# Altium project DC_Measure.PrjPcb
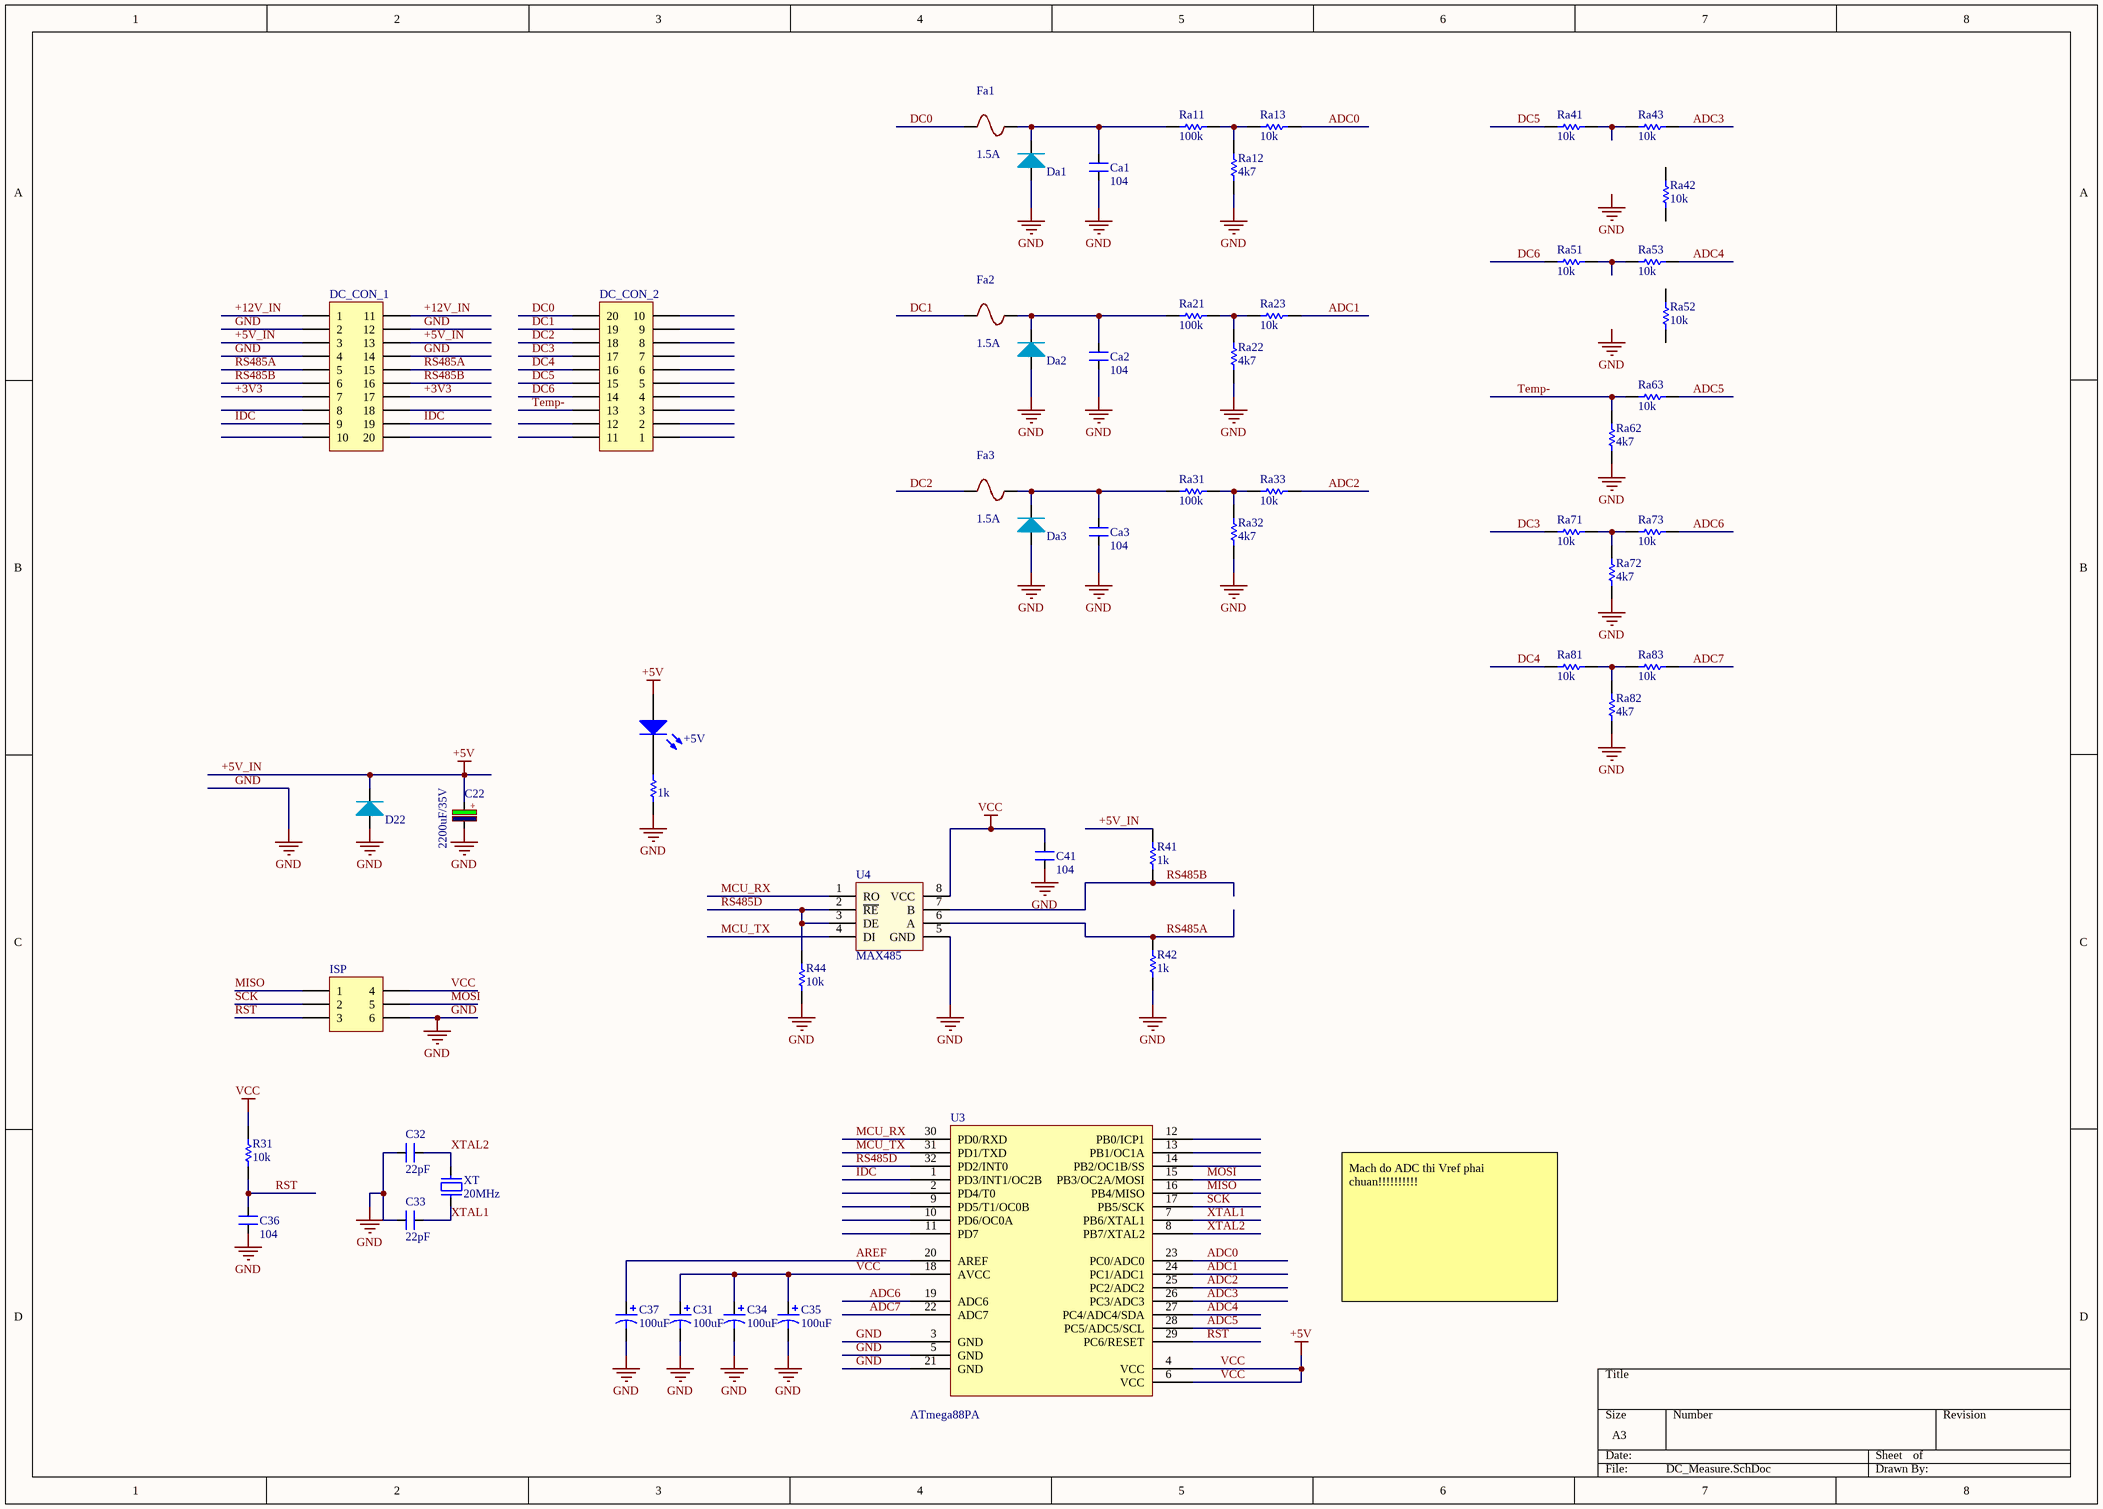
[diagram p0: DC_Measure.SchDoc]
1 sheet, 54 parts. Net scope: global (net labels, ports and power ports of the same name join across sheets).
Board file: DC_Measure.PcbDoc

## Sheet DC_Measure.SchDoc
size A3

### Parts
+5V  Led  [LED 5mm RED]  (value not drawn)
C22  2200uF/35V  [CAP_ELEC_SIZE_G]
C31  value 100uF  [CAPC2012N_F]  (hidden comment: Cap)
C32  value 22pF  [CAPC1608N]  (hidden comment: CAP NP)
C33  value 22pF  [CAPC1608N]  (hidden comment: CAP NP)
C34  value 100uF  [CAPC2012N_F]  (hidden comment: Cap)
C35  value 100uF  [CAPC2012N_F]  (hidden comment: Cap)
C36  value 104  [CAPC1608N]  (hidden comment: CAP NP)
C37  value 100uF  [CAPC2012N_F]  (hidden comment: Cap)
C41  value 104  [CAPC2012N_F]  (hidden comment: 100nF/104)
Ca1  value 104  [CAPC2012N_F]  (hidden comment: CAP NP)
Ca2  value 104  [CAPC2012N_F]  (hidden comment: CAP NP)
Ca3  value 104  [CAPC2012N_F]  (hidden comment: CAP NP)
D22  Diode  [DO-214AC]  (value not drawn)
Da1  Diode  [DO-214AC]  (value not drawn)
Da2  Diode  [DO-214AC]  (value not drawn)
Da3  Diode  [DO-214AC]  (value not drawn)
DC_CON_1  Header 10X2A  [OMC10]  (value not drawn)
DC_CON_2  Header 10X2A  [OMC10]  (value not drawn)
Fa1  1.5A  [SMD 1206]
Fa2  1.5A  [SMD 1206]
Fa3  1.5A  [SMD 1206]
ISP  Header 3X2A  [HDR2X3_CEN]  (value not drawn)
R22  value 1k  [RESC2012N_F]  (hidden comment: Res_0805_1k)
R31  value 10k  [RESC1608N_ZERO]  (hidden comment: Res)
R41  1k  [RESC1608N_ZERO]
R42  1k  [RESC1608N_ZERO]
R44  value 10k  [RESC1608N_ZERO]  (hidden comment: 330R)
Ra11  value 100k  [RESC2012N_F]  (hidden comment: Res)
Ra12  value 4k7  [RESC2012N_F]  (hidden comment: Res)
Ra13  value 10k  [RESC2012N_F]  (hidden comment: Res)
Ra21  value 100k  [RESC2012N_F]  (hidden comment: Res)
Ra22  value 4k7  [RESC2012N_F]  (hidden comment: Res)
Ra23  value 10k  [RESC2012N_F]  (hidden comment: Res)
Ra31  value 100k  [RESC2012N_F]  (hidden comment: Res)
Ra32  value 4k7  [RESC2012N_F]  (hidden comment: Res)
Ra33  value 10k  [RESC2012N_F]  (hidden comment: Res)
Ra41  value 10k  [RESC2012N_F]  (hidden comment: Res)
Ra42  value 10k  [RESC2012N_F]  (hidden comment: Res)
Ra43  value 10k  [RESC2012N_F]  (hidden comment: Res)
Ra51  value 10k  [RESC2012N_F]  (hidden comment: Res)
Ra52  value 10k  [RESC2012N_F]  (hidden comment: Res)
Ra53  value 10k  [RESC2012N_F]  (hidden comment: Res)
Ra62  value 4k7  [RESC2012N_F]  (hidden comment: Res)
Ra63  value 10k  [RESC2012N_F]  (hidden comment: Res)
Ra71  value 10k  [RESC2012N_F]  (hidden comment: Res)
Ra72  value 4k7  [RESC2012N_F]  (hidden comment: Res)
Ra73  value 10k  [RESC2012N_F]  (hidden comment: Res)
Ra81  value 10k  [RESC2012N_F]  (hidden comment: Res)
Ra82  value 4k7  [RESC2012N_F]  (hidden comment: Res)
Ra83  value 10k  [RESC2012N_F]  (hidden comment: Res)
U3  ATmega88PA  [32PIN]
U4  MAX485  [SO-8]
XT  20MHz  [XT2]

### Nets
+5V_IN: +5V.1(A) C22.1 C31.1 C34.1 C35.1 C41.2 D22.2(K) DC_CON_1.3 DC_CON_1.13 ISP.4 R31.2 R41.2 U3.4(VCC) U3.6(VCC) U3.18(AVCC) U4.8(VCC)  [also labelled +5V, VCC]
GND: C22.2 C31.2 C32.2 C33.2 C34.2 C35.2 C36.1 C37.2 C41.1 Ca1.1 Ca2.1 Ca3.1 D22.1(A) Da1.1(A) Da2.1(A) Da3.1(A) DC_CON_1.2 DC_CON_1.4 DC_CON_1.12 DC_CON_1.14 ISP.6 R22.2 R42.1 R44.1 Ra12.1 Ra22.2 Ra32.1 Ra62.1 Ra72.2 Ra82.2 U3.3(GND) U3.5(GND) U3.21(GND) U4.5(GND)
+3V3: DC_CON_1.7 DC_CON_1.17
+12V_IN: DC_CON_1.1 DC_CON_1.11
ADC0: Ra13.1 U3.23(PC0/ADC0)
ADC1: Ra23.2 U3.24(PC1/ADC1)
ADC2: Ra33.1 U3.25(PC2/ADC2)
ADC3: Ra43.1 U3.26(PC3/ADC3)
ADC4: Ra53.2 U3.27(PC4/ADC4/SDA)
ADC5: Ra63.1 U3.28(PC5/ADC5/SCL)
ADC6: Ra73.2 U3.19(ADC6)
ADC7: Ra83.2 U3.22(ADC7)
AREF: C37.1 U3.20(AREF)
DC0: DC_CON_2.20 Fa1.1
DC1: DC_CON_2.19 Fa2.1
DC2: DC_CON_2.18 Fa3.1
DC3: DC_CON_2.17 Ra71.2
DC4: DC_CON_2.16 Ra81.2
DC5: DC_CON_2.15 Ra41.1
DC6: DC_CON_2.14 Ra51.2
IDC: DC_CON_1.9 DC_CON_1.19 U3.1(PD3/INT1/OC2B)
MCU_RX: U3.30(PD0/RXD) U4.1(RO)
MCU_TX: U3.31(PD1/TXD) U4.4(DI)
MISO: ISP.1 U3.16(PB4/MISO)
MOSI: ISP.5 U3.15(PB3/OC2A/MOSI)
RS485A: DC_CON_1.5 DC_CON_1.15 R42.2 U4.6(A)
RS485B: DC_CON_1.6 DC_CON_1.16 R41.1 U4.7(B)
RS485D: R44.2 U3.32(PD2/INT0) U4.2(~{RE}) U4.3(DE)
RST: C36.2 ISP.3 R31.1 U3.29(PC6/RESET)
SCK: ISP.2 U3.17(PB5/SCK)
Temp-: DC_CON_2.13 Ra62.2 Ra63.2
XTAL1: C33.1 U3.7(PB6/XTAL1) XT.1
XTAL2: C32.1 U3.8(PB7/XTAL2) XT.2
Net+5V_2: +5V.2(K) R22.1
NetCa1_2: Ca1.2 Da1.2(K) Fa1.2 Ra11.1
NetCa2_2: Ca2.2 Da2.2(K) Fa2.2 Ra21.2
NetCa3_2: Ca3.2 Da3.2(K) Fa3.2 Ra31.1
NetRa11_2: Ra11.2 Ra12.2 Ra13.2
NetRa21_1: Ra21.1 Ra22.1 Ra23.1
NetRa31_2: Ra31.2 Ra32.2 Ra33.2
NetRa41_2: Ra41.2 Ra43.2
NetRa51_1: Ra51.1 Ra53.1
NetRa71_1: Ra71.1 Ra72.1 Ra73.1
NetRa81_1: Ra81.1 Ra82.1 Ra83.1

Not connected (* = marked no-connect by the designer): DC_CON_1 8 10 18 20; DC_CON_2 1 2 3 4 5 6 7 8 9 10 11 12; Ra42 1 2; Ra52 1 2; U3 2(PD4/T0) 9(PD5/T1/OC0B) 10(PD6/OC0A) 11(PD7) 12(PB0/ICP1) 13(PB1/OC1A) 14(PB2/OC1B/SS)

### Notes on the sheet
- Mach do ADC thi Vref phai chuan!!!!!!!!!!
- Labels drawn without touching a wire or pin: GND
- (in symbol CP4) +

### Library data of the parts
+5V = Led: pin to pad: 1>A 2>K
C22 = CP4: Cap 1000uF/16V - 220uF/50V; Description 5: 4,7uF>10uF/250V_3,3uF>10uF/400V - 2,2uF>4,7uF/450V; Description 1: 2200uF-3300uF/6,3V - 1000uF-2200uF/10V; Description 2: 1000uF/16V - 470uF => 1000uF/25V - 100uF/100V; Description 3: 330uF>470uF/35V_220uF>470uF/50V_10uF>22uF/250V; Description 4: 220uF => 330uF/63V - 10uF =>33uF/160 - 200V; Value: 1000uF/16V
C41 = CAP NP
D22 Da1-Da3 = Diode: pin to pad: 1>A 2>K
DC_CON_1 DC_CON_2 = Header 10X2A: Header, 10-Pin, Dual row; LatestRevisionDate: 17-Jul-2002; LatestRevisionNote: Re-released for DXP Platform.; Publisher: Altium Limited
Fa1-Fa3 = Fuse
ISP = Header 3X2A: Header, 3-Pin, Dual row; LatestRevisionDate: 17-Jul-2002; LatestRevisionNote: Re-released for DXP Platform.; Publisher: Altium Limited
R22 = Res
R41 R42 R44 = Res: Tro dan
  R41 R42: Value: 1k
U3 = ATmega48/168/328
U4 = MAX485: RS232 - RS485 (Same sn75176)
XT = Crystal